# EAGLE design Carduino (EAGLE 9.6.2)
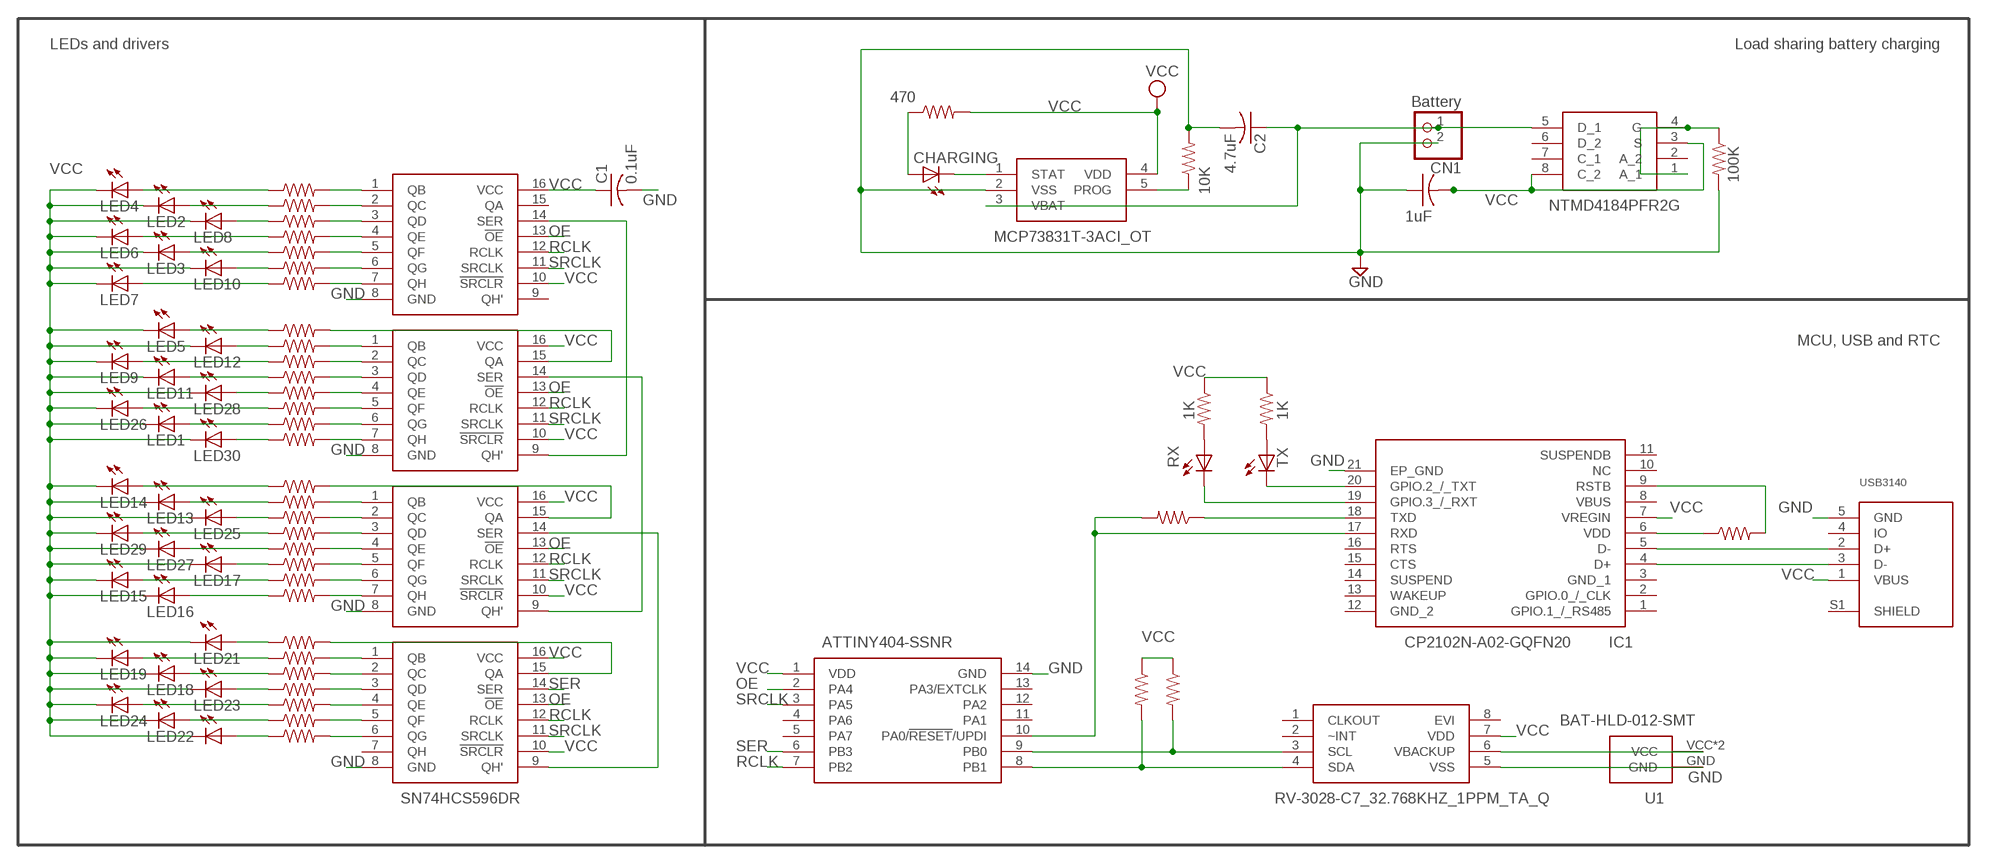
[diagram p0: schematic, sheet 1]

## Parts
C1  0.1uF  C-USC1206  [C1206]
C2  4.7uF  C-USC1206  [C1206]
C3  1uF  C-USC1206  [C1206]
CHARGING  Red  LEDCHIP-LED0805  [CHIP-LED0805]
CN1  Battery  JST_2PIN-SMT-RA  [JST-PH-2-SMT-RA]
IC1  CP2102N-A02-GQFN20  [CP2102NA02GQFN20]
IC3  SN74HCS596DR  [SOIC127P600X175-16N]
IC4  SN74HCS596DR  [SOIC127P600X175-16N]
IC5  SN74HCS596DR  [SOIC127P600X175-16N]
IC6  SN74HCS596DR  [SOIC127P600X175-16N]
IC7  NTMD4184PFR2G  [SOIC127P600X175-8N]
IC8  ATTINY404-SSNR  [SOIC127P600X175-14N]
IC9  MCP73831T-3ACI_OT  [SOT95P270X145-5N]
IC11  RV-3028-C7_32.768KHZ_1PPM_TA_Q  [RV3028C732768KHZ1PPMTAQC]
LED1  LUXEON2835L128-1890NA3500001  [LUXEON2835]
LED2  LUXEON2835L128-1890NA3500001  [LUXEON2835]
LED3  LUXEON2835L128-1890NA3500001  [LUXEON2835]
LED4  LUXEON2835L128-1890NA3500001  [LUXEON2835]
LED5  LUXEON2835L128-1890NA3500001  [LUXEON2835]
LED6  LUXEON2835L128-1890NA3500001  [LUXEON2835]
LED7  LUXEON2835L128-1890NA3500001  [LUXEON2835]
LED8  LUXEON2835L128-1890NA3500001  [LUXEON2835]
LED9  LUXEON2835L128-1890NA3500001  [LUXEON2835]
LED10  LUXEON2835L128-1890NA3500001  [LUXEON2835]
LED11  LUXEON2835L128-1890NA3500001  [LUXEON2835]
LED12  LUXEON2835L128-1890NA3500001  [LUXEON2835]
LED13  LUXEON2835L128-1890NA3500001  [LUXEON2835]
LED14  LUXEON2835L128-1890NA3500001  [LUXEON2835]
LED15  LUXEON2835L128-1890NA3500001  [LUXEON2835]
LED16  LUXEON2835L128-1890NA3500001  [LUXEON2835]
LED17  LUXEON2835L128-1890NA3500001  [LUXEON2835]
LED18  LUXEON2835L128-1890NA3500001  [LUXEON2835]
LED19  LUXEON2835L128-1890NA3500001  [LUXEON2835]
LED20  LUXEON2835L128-1890NA3500001  [LUXEON2835]
LED21  LUXEON2835L128-1890NA3500001  [LUXEON2835]
LED22  LUXEON2835L128-1890NA3500001  [LUXEON2835]
LED23  LUXEON2835L128-1890NA3500001  [LUXEON2835]
LED24  LUXEON2835L128-1890NA3500001  [LUXEON2835]
LED25  LUXEON2835L128-1890NA3500001  [LUXEON2835]
LED26  LUXEON2835L128-1890NA3500001  [LUXEON2835]
LED27  LUXEON2835L128-1890NA3500001  [LUXEON2835]
LED28  LUXEON2835L128-1890NA3500001  [LUXEON2835]
LED29  LUXEON2835L128-1890NA3500001  [LUXEON2835]
LED30  LUXEON2835L128-1890NA3500001  [LUXEON2835]
R1  470  R-US_R0805  [R0805]
R2  1K  R-US_R0805  [R0805]
R3  1K  R-US_R0805  [R0805]
R4  4.7K  R-US_R0805  [R0805]
R5  4.7K  R-US_R0805  [R0805]
R7  1K  R-US_R0805  [R0805]
R8  1K  R-US_R0805  [R0805]
R9  1K  R-US_R0805  [R0805]
R10  1K  R-US_R0805  [R0805]
R11  1K  R-US_R0805  [R0805]
R12  1K  R-US_R0805  [R0805]
R13  1K  R-US_R0805  [R0805]
R14  1K  R-US_R0805  [R0805]
R15  1K  R-US_R0805  [R0805]
R16  470  R-US_R0805  [R0805]
R17  1K  R-US_R0805  [R0805]
R18  1K  R-US_R0805  [R0805]
R19  1K  R-US_R0805  [R0805]
R20  1K  R-US_R0805  [R0805]
R21  100K  R-US_R0805  [R0805]
R22  10K  R-US_R0805  [R0805]
R23  1K  R-US_R0805  [R0805]
R31  1K  R-US_R0805  [R0805]
R32  1K  R-US_R0805  [R0805]
R33  1K  R-US_R0805  [R0805]
R34  1K  R-US_R0805  [R0805]
R35  1K  R-US_R0805  [R0805]
R36  1K  R-US_R0805  [R0805]
R37  1K  R-US_R0805  [R0805]
R38  1K  R-US_R0805  [R0805]
R39  1K  R-US_R0805  [R0805]
R40  1K  R-US_R0805  [R0805]
R41  1K  R-US_R0805  [R0805]
R42  1K  R-US_R0805  [R0805]
R43  1K  R-US_R0805  [R0805]
R44  1K  R-US_R0805  [R0805]
R45  1K  R-US_R0805  [R0805]
R46  1K  R-US_R0805  [R0805]
R47  1K  R-US_R0805  [R0805]
RX  Green  LEDCHIP-LED0805  [CHIP-LED0805]
TX  Red  LEDCHIP-LED0805  [CHIP-LED0805]
U1  BAT-HLD-012-SMT  [BATHLD012SMT]
U$5  USB3140  [USB3140-30-0170-0-C]

## Nets
GND: C1.2 C2.2 C3.1 CN1.2 IC1.21(EP_GND) IC3.8(GND) IC4.8(GND) IC5.8(GND) IC6.8(GND) IC8.14(GND) IC9.2(VSS) IC11.5(VSS) R21.2 R22.2 U1.GND U$5.5(GND)
N$1: LED4.ANODE(A) R15.1
N$2: LED2.ANODE(A) R14.1
N$3: LED8.ANODE(A) R13.1
N$4: LED6.ANODE(A) R12.1
N$5: LED3.ANODE(A) R11.1
N$6: LED12.ANODE(A) R7.1
N$7: LED7.ANODE(A) R9.1
N$8: LED5.ANODE(A) R8.1
N$9: LED10.ANODE(A) R10.1
N$10: LED9.ANODE(A) R17.1
N$11: LED11.ANODE(A) R18.1
N$12: LED28.ANODE(A) R19.1
N$13: LED26.ANODE(A) R20.1
N$14: LED1.ANODE(A) R31.1
N$15: LED30.ANODE(A) R32.1
N$16: LED14.ANODE(A) R33.1
N$17: LED13.ANODE(A) R34.1
N$18: LED25.ANODE(A) R35.1
N$19: LED29.ANODE(A) R36.1
N$20: LED27.ANODE(A) R37.1
N$21: LED17.ANODE(A) R38.1
N$22: LED15.ANODE(A) R39.1
N$23: LED16.ANODE(A) R40.1
N$24: LED21.ANODE(A) R41.1
N$25: LED19.ANODE(A) R42.1
N$26: LED18.ANODE(A) R43.1
N$27: LED23.ANODE(A) R44.1
N$28: LED24.ANODE(A) R45.1
N$29: LED22.ANODE(A) R46.1
N$30: LED20.ANODE(A) R47.1
N$31: IC8.8(PB1) IC11.4(SDA) R4.2
N$32: IC8.9(PB0) IC11.3(SCL) R5.2
N$33: IC11.6(VBACKUP) U1.VCC U1.VCC2(VCC)
N$36: IC7.1(A_1) IC7.4(G) R21.1
N$37: IC9.5(PROG) R22.1
N$38: C2.1 CN1.1 IC7.5(D_1) IC9.3(VBAT)
N$39: CHARGING.C IC9.1(STAT)
N$40: CHARGING.A R16.1
N$41: IC1.20(GPIO.2_/_TXT) TX.C
N$42: IC1.19(GPIO.3_/_RXT) RX.C
N$43: IC1.18(TXD) R1.1
N$44: IC1.6(VDD) R23.1
N$45: IC1.9(RSTB) R23.2
N$53: IC3.1(QB) R15.2
N$56: IC3.2(QC) R14.2
N$57: IC3.3(QD) R13.2
N$58: IC3.4(QE) R12.2
N$59: IC3.5(QF) R11.2
N$60: IC3.6(QG) R10.2
N$61: IC3.7(QH) R9.2
N$62: IC4.15(QA) R8.2
N$63: IC4.1(QB) R7.2
N$64: IC4.2(QC) R17.2
N$65: IC4.3(QD) R18.2
N$66: IC4.4(QE) R19.2
N$68: IC4.5(QF) R20.2
N$69: IC4.6(QG) R31.2
N$70: IC4.7(QH) R32.2
N$71: IC5.15(QA) R33.2
N$72: IC5.1(QB) R34.2
N$73: IC5.2(QC) R35.2
N$74: IC5.3(QD) R36.2
N$75: IC5.4(QE) R37.2
N$82: IC5.5(QF) R38.2
N$83: IC5.6(QG) R39.2
N$84: IC5.7(QH) R40.2
N$86: IC6.6(QG) R47.2
N$87: IC6.5(QF) R46.2
N$88: IC6.4(QE) R45.2
N$89: IC6.3(QD) R44.2
N$90: IC6.2(QC) R43.2
N$91: IC6.1(QB) R42.2
N$92: IC6.15(QA) R41.2
N$93: IC5.14(SER) IC6.9(QH')
N$94: IC4.14(SER) IC5.9(QH')
N$95: IC3.14(SER) IC4.9(QH')
N$99: IC1.5(D-) U$5.2(D+)
N$100: IC1.4(D+) U$5.3(D-)
N$103: IC1.17(RXD) IC8.10(PA0/!RESET!/UPDI) R1.2
N$104: R2.2 RX.A
N$105: R3.2 TX.A
OE: IC3.13(!OE) IC4.13(!OE) IC5.13(!OE) IC6.13(!OE) IC8.2(PA4)
RCLK: IC3.12(RCLK) IC4.12(RCLK) IC5.12(RCLK) IC6.12(RCLK) IC8.7(PB2)
SER: IC6.14(SER) IC8.6(PB3)
SRCLK: IC3.11(SRCLK) IC4.11(SRCLK) IC5.11(SRCLK) IC6.11(SRCLK) IC8.3(PA5)
VCC: C1.1 C3.2 IC1.7(VREGIN) IC3.10(!SRCLR) IC3.16(VCC) IC4.10(!SRCLR) IC4.16(VCC) IC5.10(!SRCLR) IC5.16(VCC) IC6.10(!SRCLR) IC6.16(VCC) IC7.3(S) IC7.8(C_2) IC8.1(VDD) IC9.4(VDD) IC11.7(VDD) LED1.CATHODE(C) LED2.CATHODE(C) LED3.CATHODE(C) LED4.CATHODE(C) LED5.CATHODE(C) LED6.CATHODE(C) LED7.CATHODE(C) LED8.CATHODE(C) LED9.CATHODE(C) LED10.CATHODE(C) LED11.CATHODE(C) LED12.CATHODE(C) LED13.CATHODE(C) LED14.CATHODE(C) LED15.CATHODE(C) LED16.CATHODE(C) LED17.CATHODE(C) LED18.CATHODE(C) LED19.CATHODE(C) LED20.CATHODE(C) LED21.CATHODE(C) LED22.CATHODE(C) LED23.CATHODE(C) LED24.CATHODE(C) LED25.CATHODE(C) LED26.CATHODE(C) LED27.CATHODE(C) LED28.CATHODE(C) LED29.CATHODE(C) LED30.CATHODE(C) R2.1 R3.1 R4.1 R5.1 R16.2 U$5.1(VBUS)
Unconnected: IC1.1(GPIO.1_/_RS485) IC1.2(GPIO.0_/_CLK) IC1.3(GND_1) IC1.8(VBUS) IC1.10(NC) IC1.11(SUSPENDB) IC1.12(GND_2) IC1.13(WAKEUP) IC1.14(SUSPEND) IC1.15(CTS) IC1.16(RTS) IC3.9(QH') IC3.15(QA) IC6.7(QH) IC7.2(A_2) IC7.6(D_2) IC7.7(C_1) IC8.4(PA6) IC8.5(PA7) IC8.11(PA1) IC8.12(PA2) IC8.13(PA3/EXTCLK) IC11.1(CLKOUT) IC11.2(~INT) IC11.8(EVI) U$5.4(IO) U$5.S1(SHIELD)

## Notes on the sheet
- LEDs and drivers | Load sharing battery charging
- MCU, USB and RTC

## Library data of the parts
C1-C3 = resistor:C-US: CAPACITOR, American symbol
CHARGING RX TX = adafruit:LED: LED OSRAM: - CHIPLED LG R971, LG N971, LY N971, LG Q971, LY Q971, LO R971, LY R971 LH N974, LH R974 LS Q976, LO Q976, LY Q976 LO Q996 - Hyper CHIPLED LW Q18S LB Q993, LB Q99A, LB R99A - SideLED LS A670, LO A670, LY A670, LG A670, LP A670 LB A673, LV A673, LT A673, LW A673 LH A674 LY A675 LS A676, LA A676, LO A676, LY A676, LW A676 LS A679, LY A679, LG A679 - Hyper Micro SIDELED® LS Y876, LA Y876, LO Y876, LY Y876 LT Y87S - SmartLED LW L88C, LW L88S LB L89C, LB L89S, LG L890 LS L89K, LO L89K, LY L89K LS L896, LA L896, LO L896, LY L896 - TOPLED LS T670, LO T670, LY T670, LG T670, LP T670 LSG T670, LSP T670, LSY T670, LOP T670, LYG T670 LG T671, LOG T671, LSG T671 LB T673, LV T673, LT T673, LW T673 LH T674 LS T676, LA T676, LO T676, LY T676, LB T676, LH T676, LSB T676, LW T676 LB T67C, LV T67C, LT T67C, LS T67K, LO T67K, LY T67K, LW E67C LS E67B, LA E67B, LO E67B, LY E67B, LB E67C, LV E67C, LT E67C LW T67C LS T679, LY T679, LG T679 LS T770, LO T770, LY T770, LG T770, LP T770 LB T773, LV T773, LT T773, LW T773 LH T774 LS E675, LA E675, LY E675, LS T675 LS T776, LA T776, LO T776, LY T776, LB T776 LHGB T686 LT T68C, LB T68C - Hyper Mini TOPLED® LB M676 - Mini TOPLED Santana® LG M470 LS M47K, LO M47K, LY M47K Source: http://www.osram.convergy.de/
CN1 = adafruit:JST_2PIN: JST 2-Pin Connectors of various flavors SMT-RA (S2B-PH-SM4) 4UConnector #17311 SMT (B2B-PH-SM4) THM-RA (S2B-PH) THM (B2B-PH)
IC1 = SamacSys_Parts:CP2102N-A02-GQFN20: USB Interface IC USB to UART bridge - QFN20 Source: Datasheet <https://www.silabs.com/documents/public/data-sheets/cp2102n-datasheet.pdf>; DESCRIPTION: USB Interface IC USB to UART bridge - QFN20; HEIGHT: 0.8mm; MANUFACTURER_NAME: Silicon Labs; MANUFACTURER_PART_NUMBER: CP2102N-A02-GQFN20; MOUSER_PART_NUMBER: 634-CP2102NA02GQFN20; MOUSER_PRICE-STOCK: https://www.mouser.co.uk/ProductDetail/Silicon-Labs/CP2102N-A02-GQFN20?qs=u16ybLDytRaG8WdlP0fT2g%3D%3D
IC3-IC6 = SamacSys_Parts:SN74HCS596DR: Counter Shift Registers 8-bit serial-in/parallel-out shift register 16-SOIC -40 to 125 Source: Datasheet <https://www.ti.com/lit/ds/symlink/sn74hcs596.pdf>; DESCRIPTION: Counter Shift Registers 8-bit serial-in/parallel-out shift register 16-SOIC -40 to 125; HEIGHT: 1.75mm; MANUFACTURER_NAME: Texas Instruments; MANUFACTURER_PART_NUMBER: SN74HCS596DR; MOUSER_PART_NUMBER: 595-SN74HCS596DR; MOUSER_PRICE-STOCK: https://www.mouser.co.uk/ProductDetail/Texas-Instruments/SN74HCS596DR?qs=81r%252BiQLm7BSUYWKUZRnoUA%3D%3D
IC7 = SamacSys_Parts:NTMD4184PFR2G: MOSFET PFET FTKY S08 30V TR 3.8A Source: Datasheet <https://www.onsemi.com/pub/Collateral/NTMD4184PF-D.PDF>; DESCRIPTION: MOSFET PFET FTKY S08 30V TR 3.8A; HEIGHT: 1.75mm; MANUFACTURER_NAME: ON Semiconductor; MANUFACTURER_PART_NUMBER: NTMD4184PFR2G; MOUSER_PART_NUMBER: 863-NTMD4184PFR2G; MOUSER_PRICE-STOCK: https://www.mouser.co.uk/ProductDetail/ON-Semiconductor/NTMD4184PFR2G?qs=WOJDpfhxrCZPr5mnWPOi%252BQ%3D%3D
IC8 = SamacSys_Parts:ATTINY404-SSNR: MICROCHIP - ATTINY404-SSNR - MCU, 8BIT, 20MHZ, SOIC-14 Source: Datasheet <https://datasheet.datasheetarchive.com/originals/distributors/DKDS-39/8204.pdf>; DESCRIPTION: MICROCHIP - ATTINY404-SSNR - MCU, 8BIT, 20MHZ, SOIC-14; HEIGHT: 1.75mm; MANUFACTURER_NAME: Microchip; MANUFACTURER_PART_NUMBER: ATTINY404-SSNR; MOUSER_PART_NUMBER: 556-ATTINY404-SSNR; MOUSER_PRICE-STOCK: https://www.mouser.co.uk/ProductDetail/Microchip-Technology-Atmel/ATTINY404-SSNR?qs=F5EMLAvA7IAEqD7Aw0z%252B9Q%3D%3D
IC9 = SamacSys_Parts:MCP73831T-3ACI_OT: MICROCHIP - MCP73831T-3ACI/OT - BATT CHARGER, -40 TO 85DEG C Source: Datasheet <http://ww1.microchip.com/downloads/en/DeviceDoc/20001984g.pdf>; DESCRIPTION: MICROCHIP - MCP73831T-3ACI/OT - BATT CHARGER, -40 TO 85DEG C; HEIGHT: 1.45mm; MANUFACTURER_NAME: Microchip; MANUFACTURER_PART_NUMBER: MCP73831T-3ACI/OT; MOUSER_PART_NUMBER: 579-MCP73831T-3ACIOT; MOUSER_PRICE-STOCK: https://www.mouser.co.uk/ProductDetail/Microchip-Technology/MCP73831T-3ACI-OT?qs=yUQqVecv4quInAWkk8YFWg%3D%3D
IC11 = SamacSys_Parts:RV-3028-C7_32.768KHZ_1PPM_TA_Q: Real Time Clock 32.768kHz I2C Time Acc. 1ppm Source: Datasheet <https://www.mouser.de/datasheet/2/530/RV_3028_C7-1524919.pdf>; DESCRIPTION: Real Time Clock 32.768kHz I2C Time Acc. 1ppm; HEIGHT: 0.8mm; MANUFACTURER_NAME: Micro Crystal AG; MANUFACTURER_PART_NUMBER: RV-3028-C7 32.768kHz 1ppm TA QC; MOUSER_PART_NUMBER: 428-203591-MG01; MOUSER_PRICE-STOCK: https://www.mouser.co.uk/ProductDetail/Micro-Crystal/RV-3028-C7-32768kHz-1ppm-TA-QC?qs=u16ybLDytRaU7ZFJl2AxfQ%3D%3D
LED1-LED30 = spkl:LUXEON2835
R1-R5 R7-R23 R31-R47 = adafruit:R-US_: RESISTOR, American symbol
U1 = SamacSys_Parts:BAT-HLD-012-SMT: Coin Cell Battery Holders Bat Hld CR1216/1225 Surface Mount Source: Datasheet <https://linxtechnologies.com/wp/wp-content/uploads/bat-hld-012-smt.pdf>; DESCRIPTION: Coin Cell Battery Holders Bat Hld CR1216/1225 Surface Mount; HEIGHT: 3mm; MANUFACTURER_NAME: Linx Technologies; MANUFACTURER_PART_NUMBER: BAT-HLD-012-SMT; MOUSER_PART_NUMBER: 712-BAT-HLD-012-SMT; MOUSER_PRICE-STOCK: https://www.mouser.co.uk/ProductDetail/Linx-Technologies/BAT-HLD-012-SMT?qs=Z0V%2FpEl%252BOGfZsSJil9WIXw%3D%3D
U$5 = USB:USB3140

## Board
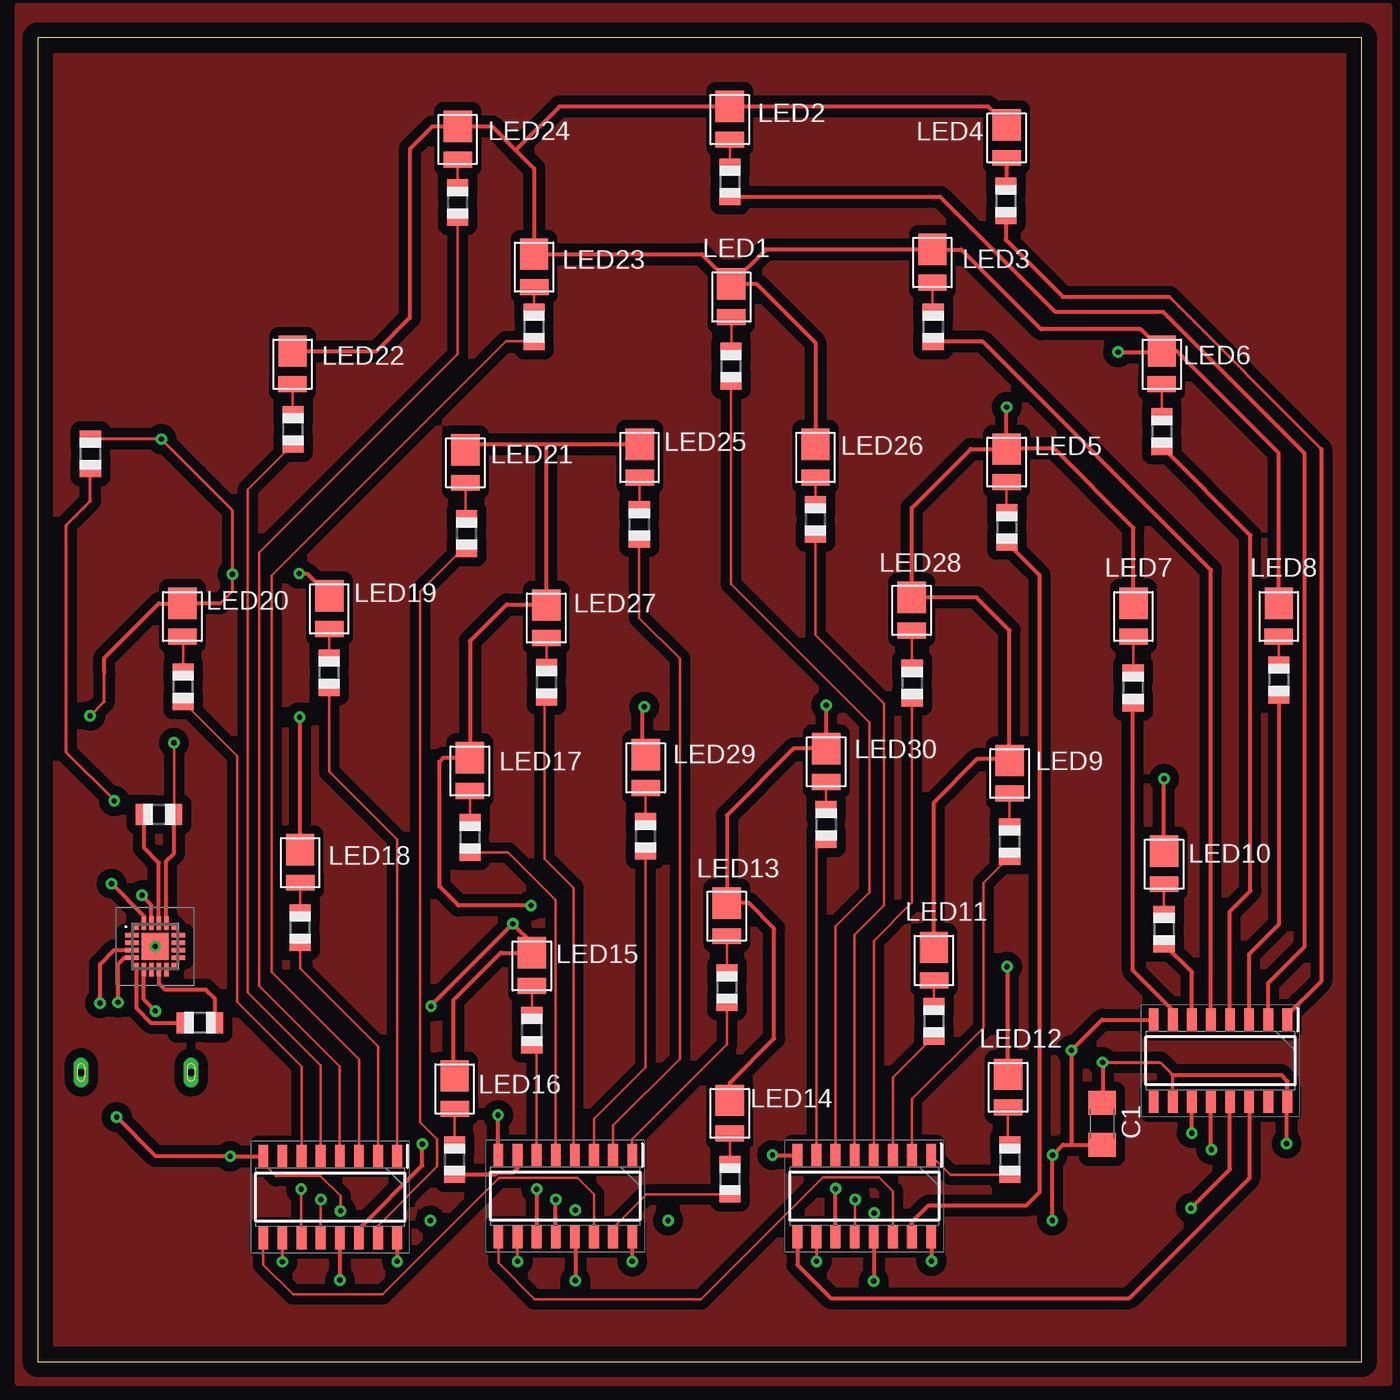
[diagram p1: board, top side]
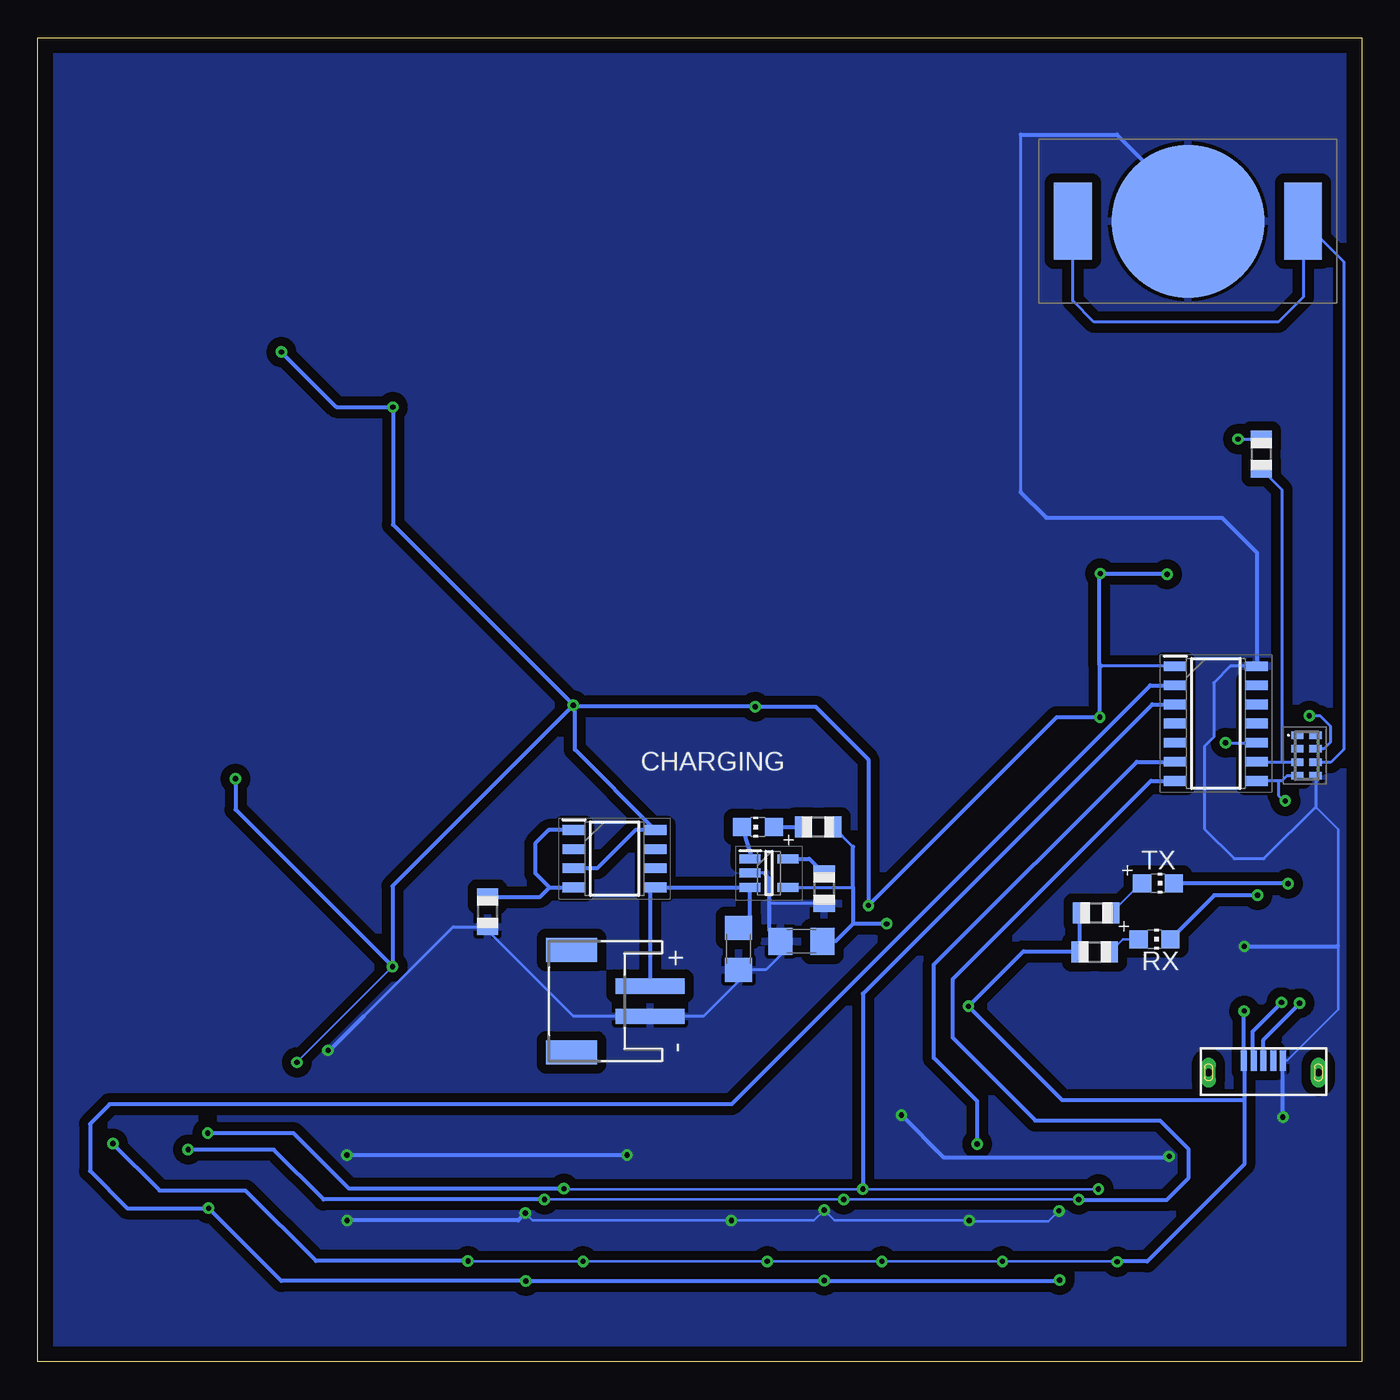
[diagram p2: board, bottom side, seen from below]

Size 88 x 88 mm. Coordinates in mm from the lower left corner, seen from the top.
Outline: 0,0 88,0 88,88 0,88 0,0
Copper layers (1*16): Top 0.035mm / dielectric 1.5mm / Bottom 0.035mm
Design rules "default": minimum track width 6mil, minimum drill 0.35mm, track to track 6mil, track to pad 6mil, pad to pad 6mil, via to via 6mil, smd to smd 6mil, copper to edge 40mil, drill to drill 6mil, minimum pad ring 10mil, minimum via ring 8mil, stop-mask expansion 4mil, vias tented up to drill 0mil, thermal gap 10mil

### Footprints (pad centres in the part's own frame; a part is rotated, then mirrored left to right if it is on the bottom)
C1206 = smd 1.6 x 1.8: 1 -1.4,0; 2 1.4,0
CHIP-LED0805 = smd 1.2 x 1.2: A 0,-1.05; C 0,1.05
JST-PH-2-SMT-RA = smd 1 x 4.6: 1 1,-3.7; 2 -1,-3.7 | smd 1.6 x 3.4: NC1 -3.4,1.5; NC2 3.4,1.5
CP2102NA02GQFN20 = smd 0.3 x 0.3: 1 -1.25,1.25; 6 -1.25,-1.25; 11 1.25,-1.25; 16 1.25,1.25 | smd 0.9 x 0.3: 2 -1.55,0.75; 3 -1.55,0.25; 4 -1.55,-0.25; 5 -1.55,-0.75; 12 1.55,-0.75; 13 1.55,-0.25; 14 1.55,0.25; 15 1.55,0.75 | smd 0.3 x 0.9: 7 -0.75,-1.55; 8 -0.25,-1.55; 9 0.25,-1.55; 10 0.75,-1.55; 17 0.75,1.55; 18 0.25,1.55; 19 -0.25,1.55; 20 -0.75,1.55 | smd 1.8 x 1.8: 21 0,0
SOIC127P600X175-16N = smd 1.525 x 0.65: 1 -2.712,4.445; 2 -2.712,3.175; 3 -2.712,1.905; 4 -2.712,0.635; 5 -2.712,-0.635; 6 -2.712,-1.905; 7 -2.712,-3.175; 8 -2.712,-4.445; 9 2.712,-4.445; 10 2.712,-3.175; 11 2.712,-1.905; 12 2.712,-0.635; 13 2.712,0.635; 14 2.712,1.905; 15 2.712,3.175; 16 2.712,4.445
SOIC127P600X175-8N = smd 1.5 x 0.65: 1 -2.7,1.905; 2 -2.7,0.635; 3 -2.7,-0.635; 4 -2.7,-1.905; 5 2.7,-1.905; 6 2.7,-0.635; 7 2.7,0.635; 8 2.7,1.905
SOIC127P600X175-14N = smd 1.5 x 0.65: 1 -2.7,3.81; 2 -2.7,2.54; 3 -2.7,1.27; 4 -2.7,0; 5 -2.7,-1.27; 6 -2.7,-2.54; 7 -2.7,-3.81; 8 2.7,-3.81; 9 2.7,-2.54; 10 2.7,-1.27; 11 2.7,0; 12 2.7,1.27; 13 2.7,2.54; 14 2.7,3.81
SOT95P270X145-5N = smd 1.4 x 0.6: 1 -1.25,0.95; 2 -1.25,0; 3 -1.25,-0.95; 4 1.25,-0.95; 5 1.25,0.95
RV3028C732768KHZ1PPMTAQC = smd 0.5 x 0.8: 1 -1.35,-0.6; 2 -0.45,-0.6; 3 0.45,-0.6; 4 1.35,-0.6; 5 1.35,0.6; 6 0.45,0.6; 7 -0.45,0.6; 8 -1.35,0.6
LUXEON2835 = smd 1 x 1.9: ANODE 1.43,0 | smd 2.03 x 1.9: CATHODE -0.77,0
R0805 = smd 1.1 x 1.4: 1 -1,0; 2 1,0
BATHLD012SMT = smd 10.16 x 10.16: GND 0,0 | smd 2.5 x 5.1: VCC -7.65,0; VCC2 7.65,0
USB3140-30-0170-0-C = smd 0.4 x 1.35: 1 -1.3,0; 2 -0.65,0; 3 0,0; 4 0.65,0; 5 1.3,0 | drill 0.5 pad 0.775 long: S1 3.65,-0.8; S3 -3.65,-0.8

### Placement (x,y rotation side)
C1  70.74,15.82 270 top
C2  41.43,27.45 270 bottom
C3  37.24,27.95 0 bottom
CHARGING  40.13,35.54 90 bottom
CN1  51.01,23.97 90 bottom
IC1  7.81,27.61 0 top
IC3  78.6,20.02 270 top
IC4  54.93,11.02 270 top
IC5  35.07,11.02 270 top
IC6  19.45,10.95 270 top
IC7  49.66,33.44 0 bottom
IC8  9.7,42.42 0 bottom
IC9  39.4,32.48 0 bottom
IC11  3.68,40.29 270 bottom
LED1  46.1,70.87 270 top
LED2  46,82.65 270 top
LED3  59.46,73.15 270 top
LED4  64.39,81.43 270 top
LED5  64.39,59.89 270 top
LED6  74.7,66.4 270 top
LED7  72.82,49.63 270 top
LED8  82.47,49.63 270 top
LED9  64.59,39.2 270 top
LED10  74.85,33.17 270 top
LED11  59.56,26.77 270 top
LED12  64.49,18.34 270 top
LED13  45.8,29.72 270 top
LED14  46,16.61 270 top
LED15  32.84,26.42 270 top
LED16  27.71,18.24 270 top
LED17  28.73,39.37 270 top
LED18  17.45,33.27 270 top
LED19  19.38,50.14 270 top
LED20  9.63,49.63 270 top
LED21  28.42,59.84 270 top
LED22  16.94,66.4 270 top
LED23  32.99,72.85 270 top
LED24  27.91,81.33 270 top
LED25  40.01,60.2 270 top
LED26  51.69,60.2 270 top
LED27  33.81,49.53 270 top
LED28  58.09,50.04 270 top
LED29  40.41,39.57 270 top
LED30  52.4,39.98 270 top
R1  8.07,36.39 0 top
R2  17.75,27.23 0 bottom
R3  17.65,29.84 0 bottom
R4  3.51,60.35 270 top
R5  6.68,60.32 270 bottom
R7  64.62,13.44 270 top
R8  64.41,55.45 270 top
R9  72.8,44.78 270 top
R10  74.85,28.75 270 top
R11  59.51,68.78 270 top
R12  74.7,61.82 270 top
R13  82.47,45.31 270 top
R14  46,78.41 270 top
R15  64.34,77.14 270 top
R16  36.13,35.54 0 bottom
R17  64.59,34.57 270 top
R18  59.56,22.63 270 top
R19  58.12,45.11 270 top
R20  51.69,55.98 270 top
R21  58.1,29.91 270 bottom
R22  35.73,31.45 270 bottom
R23  10.79,22.54 0 top
R31  46.08,66.17 270 top
R32  52.4,35.71 270 top
R33  46,12.14 270 top
R34  45.82,24.87 270 top
R35  39.98,55.65 270 top
R36  40.39,34.92 270 top
R37  33.81,45.16 270 top
R38  28.73,34.85 270 top
R39  32.84,22.05 270 top
R40  27.71,13.44 270 top
R41  28.5,55.04 270 top
R42  19.38,45.8 270 top
R43  17.45,28.85 270 top
R44  32.99,68.78 270 top
R45  27.91,77.04 270 top
R46  16.97,61.98 270 top
R47  9.68,44.86 270 top
RX  13.79,28.09 270 bottom
TX  13.55,31.81 270 bottom
U1  11.56,75.79 0 bottom
U$5  6.54,20.03 0 bottom

### Tracks (layer width: path | path; a pad name or v marks a point on that pad's centre or on a via)
GND  (via drill 0.35)
  Top 0.152: v20.13,10.03 20.13,11.02 18.79,12.37 15.86,12.37 15.84,12.34 15,13.18 15,13.5
  Top 0.254: v67.43,9.39 67.43,13.76 v67.45,13.74 68.14,14.42 68.7,14.42 | 68.7,14.42 v68.7,20.7 70.73,22.73 IC3.8 | 68.7,14.42 C1.2 | v48.83,13.74 IC4.8 | IC5.8 30.6,13.76 v30.6,16.4 | 15,13.5 IC6.8 v12.8,13.66 7.86,13.66 v5.25,16.27
  Bottom 0.152: v20.13,10.03 20.83,9.33 26.05,9.33 v26.1,9.38 26.13,9.41 35.06,9.41 v35.73,10.08 36.42,9.39 41.89,9.39 v41.9,9.38 41.93,9.41 55.12,9.41 v55.59,9.88 | 3.04,36.83 1.58,35.37 1.58,27.67 1.58,23.42 4.97,20.03 5.12,20.03 | 5.12,20.03 U$5.5 | 5.22,19.93 5.12,20.03
  Bottom 0.2: 3.08,36.87 6.51,33.44 8.49,33.44 10.47,35.42 10.47,40.9 9.85,41.52 9.85,45.12 8.74,46.23 IC8.14 6.97,46.26 | 22.66,81.56 22.69,81.53 22.69,57.81 | IC11.5 3.08,36.87 | 3.08,36.87 3.04,36.83 | R22.2 39.36,30.45 | 39.73,32.48 IC9.2 | 66.33,22.97 60.39,28.91 58.33,28.91 | 58.33,28.91 R21.2 | 58.33,28.91 52.39,22.97 CN1.2 43.74,22.97 41.43,25.28 C2.2 39.61,26.05 38.64,27.02 C3.1
  Bottom 0.254: v55.59,9.88 56.07,9.4 v67.43,9.4 v67.43,9.39 | v30.6,16.4 27.8,13.6 12.8,13.6 v12.8,13.66 | 22.69,57.81 20.97,56.09 9.3,56.09 6.97,53.77 6.97,46.26 | 22.66,81.56 16.27,81.56 11.56,76.85 U1.GND | 66.33,22.97 68.7,20.6 v68.7,20.7 | 39.73,32.48 39.39,32.14 39.39,30.42 | 39.36,30.45 39.39,30.42 | 38.73,28.04 C3.1 39.39,28.7 39.39,30.42 | v48.83,13.74 v67.45,13.74 | v5.25,16.27 5.25,19.9 5.22,19.93 | IC1.21 1.64,27.61 1.58,27.67
  other vias: 7.81,27.61
  pour Bottom (isolate 0.61): -1.4,89.69 89.88,89.69 89.88,-1.17 -1.4,-1.17
N$1
  Top 0.254: R15.1 64.39,78.19 LED4.ANODE
N$2
  Top 0.152: LED2.ANODE R14.1
N$3
  Top 0.152: LED8.ANODE R13.1
N$4
  Top 0.152: LED6.ANODE R12.1
N$5
  Top 0.152: LED3.ANODE 59.46,69.83 R11.1
N$6
  Top 0.152: LED12.ANODE 64.49,14.56 R7.1
N$7
  Top 0.152: LED7.ANODE 72.82,45.81 R9.1
N$8
  Top 0.152: LED5.ANODE 64.39,56.47 R8.1
N$9
  Top 0.152: LED10.ANODE R10.1
N$10
  Top 0.152: LED9.ANODE R17.1
N$11
  Top 0.152: LED11.ANODE R18.1
N$12
  Top 0.152: LED28.ANODE 58.09,46.14 R19.1
N$13
  Top 0.152: LED26.ANODE R20.1
N$14
  Top 0.152: LED1.ANODE 46.1,67.19 R31.1
N$15
  Top 0.152: LED30.ANODE R32.1
N$16
  Top 0.152: LED14.ANODE R33.1
N$17
  Top 0.152: LED13.ANODE 45.8,25.89 R34.1
N$18
  Top 0.152: LED25.ANODE 40.01,56.68 R35.1
N$19
  Top 0.152: LED29.ANODE 40.41,35.95 R36.1
N$20
  Top 0.152: LED27.ANODE R37.1
N$21
  Top 0.152: LED17.ANODE R38.1
N$22
  Top 0.152: LED15.ANODE R39.1
N$23
  Top 0.152: LED16.ANODE R40.1
N$24
  Top 0.152: LED21.ANODE 28.42,56.12 R41.1
N$25
  Top 0.152: LED19.ANODE R42.1
N$26
  Top 0.152: LED18.ANODE R43.1
N$27
  Top 0.152: LED23.ANODE R44.1
N$28
  Top 0.152: LED24.ANODE R45.1
N$29
  Top 0.152: LED22.ANODE 16.94,63 R46.1
N$30
  Top 0.152: LED20.ANODE 9.68,48.15 R47.1
N$31  (via drill 0.35)
  Top 0.2: v5.09,37.28 5.09,37.33 1.91,40.51 1.91,55.6 3.51,57.2 R4.2
  Bottom 0.2: IC11.4 4.98,38.94 5.31,38.61 5.55,38.61 | 5.55,38.61 IC8.8 | 5.55,38.61 5.55,37.64 5.14,37.23 v5.09,37.28
N$32
  Bottom 0.2: IC11.3 5.31,39.84 | 5.31,39.84 6.96,39.84 IC8.9 | R5.2 5.31,57.95 5.31,39.84
N$33
  Bottom 0.2: IC11.6 2.07,39.84 1.21,40.7 1.21,73.1 U1.VCC2 3.91,70.75 5.56,69.1 17.8,69.1 19.21,70.51 U1.VCC
N$36
  Bottom 0.254: IC7.1 54.05,35.34 54.94,34.45 54.94,32.49 53.98,31.54 | 53.98,31.54 IC7.4 | R21.1 54.61,30.91 53.98,31.54
N$37
  Bottom 0.254: IC9.5 36.71,33.43 R22.1
N$38
  Bottom 0.254: C2.1 40.65,29.63 IC9.3 IC7.5 47.31,31.18 CN1.1
N$39
  Bottom 0.254: CHARGING.C 40.56,33.52 IC9.1
N$40
  Bottom 0.254: CHARGING.A R16.1
N$41  (via drill 0.35)
  Top 0.254: IC1.20 7.06,29.63 v4.91,31.78
  Bottom 0.254: v4.91,31.78 12.48,31.78 TX.C
N$42  (via drill 0.35)
  Top 0.254: IC1.19 7.56,30.36 v6.92,31 v6.93,31.01
  Bottom 0.254: v6.93,31.01 9.82,31.01 RX.C
N$43
  Top 0.254: IC1.18 8.06,33.17 7.07,34.16 R1.1
N$44
  Top 0.254: IC1.6 6.56,23.51 7.53,22.54 R23.1
N$45
  Top 0.254: IC1.9 8.06,25.14 8.48,24.72 11.18,24.72 11.79,24.11 R23.2
N$53
  Top 0.2: 75.19,70.78 85.3,60.67
  Top 0.254: IC3.1 83.05,23.05 85.3,25.3 85.3,60.67 | R15.2 64.34,74.57 68.13,70.78 75.19,70.78
N$56
  Top 0.254: IC3.2 81.78,25.18 84.2,27.6 84.2,60.35 74.79,69.76 67.64,69.76 59.99,77.41 R14.2
N$57
  Top 0.254: IC3.3 80.51,27.11 82.5,29.1 82.5,44.29 R13.2
N$58
  Top 0.254: IC3.4 79.24,29.94 80.6,31.3 80.6,54.92 R12.2
N$59
  Top 0.254: IC3.5 77.97,52.63 62.82,67.78 R11.2
N$60
  Top 0.254: IC3.6 76.7,25.91 R10.2
N$61
  Top 0.254: IC3.7 75.43,23.37 72.8,26 R9.2
N$62
  Top 0.254: IC4.15 58.1,9.3 59.2,10.4 65.7,10.4 66.6,11.3 66.6,52.26 R8.2
N$63
  Top 0.152: IC4.1 60.67,12.44 R7.2
N$64
  Top 0.152: IC4.2 58.1,17.46 62.84,22.2 62.84,31.82 R17.2
N$65
  Top 0.152: IC4.3 56.83,18.9 R18.2
N$66
  Top 0.152: IC4.4 55.56,27.98 58.12,30.53 R19.2
N$68
  Top 0.152: IC4.5 54.29,28.39 56.24,30.33 56.24,43.74 51.69,48.28 R20.2
N$69
  Top 0.152: IC4.6 53.02,28.95 55.27,31.19 55.27,42.49 46.08,51.69 R31.2
N$70
  Top 0.152: R32.2 51.75,34.07 IC4.7
N$71
  Top 0.152: IC5.15 38.24,8.91 40.47,11.14 R33.2
N$72
  Top 0.152: IC5.1 39.51,14.8 45.82,21.11 R34.2
N$73
  Top 0.152: IC5.2 38.24,15.71 42.67,20.14 42.67,46.74 39.98,49.43 R35.2
N$74
  Top 0.152: IC5.3 36.97,16.14 40.39,19.56 R36.2
N$75
  Top 0.152: IC5.4 35.62,13.81 35.62,31.48 33.68,33.43 33.68,44.03 R37.2
N$82
  Top 0.152: IC5.5 34.41,13.76 34.41,30.69 31.25,33.85 R38.2
N$83
  Top 0.152: R39.2 33.16,20.73 IC5.6
N$84
  Top 0.254: IC5.7 31.89,12.86 31.6,12.57 30.52,12.57 30.39,12.44 R40.2
N$86
  Top 0.152: IC6.6 17.54,19.63 13.26,23.91 13.26,40.28 R47.2
N$87
  Top 0.152: IC6.5 18.81,19.7 13.97,24.54 13.97,57.98 R46.2
N$88
  Top 0.152: IC6.4 20.08,19.64 14.73,25 14.73,53.79 27.91,66.98 R45.2
N$89
  Top 0.152: IC6.3 21.35,20.1 15.54,25.91 15.54,52.25 31.11,67.82 32.96,67.82 R44.2
N$90
  Top 0.152: IC6.2 22.62,20.97 17.45,26.14 R43.2
N$91
  Top 0.152: IC6.1 23.89,34.71 19.38,39.22 R42.2
N$92
  Top 0.152: R41.2 28.27,54.04 25.43,51.2 25.43,15.91 26.56,14.78 26.56,12.98 22.62,9.04 IC6.15
N$93
  Top 0.152: IC6.9 15,6.45 16.97,4.48 22.93,4.48 30.67,12.22 35.88,12.22 36.97,11.12 IC5.14
N$94
  Top 0.152: IC5.9 30.62,6.58 33.03,4.17 44.09,4.17 52.19,12.27 55.89,12.27 56.83,11.33 IC4.14
N$95
  Top 0.254: IC4.9 50.48,6.46 52.71,4.23 72.53,4.23 80.51,12.21 IC3.14
N$99  (via drill 0.35)
  Top 0.254: v5.33,23.89 v5.34,23.9 5.34,26.43 5.77,26.86 IC1.5
  Bottom 0.152: U$5.2 7.26,20.1
  Bottom 0.254: 7.26,20.1 7.26,21.96 v5.33,23.89
N$100  (via drill 0.35)
  Top 0.254: v4.14,23.84 4.14,26.41 5.09,27.36 IC1.4
  Bottom 0.254: U$5.3 6.54,21.39 4.12,23.81 v4.14,23.84
N$103  (via drill 0.35)
  Top 0.152: R1.2 9.07,41.09
  Top 0.2: 9.07,41.09 9.04,41.12 v9.06,41.14
  Top 0.254: IC1.17 8.56,33.28 9.07,33.79 R1.2
  Bottom 0.2: v9.06,41.14 IC8.10
N$104
  Bottom 0.152: R2.2 15.89,28.09 RX.A
N$105
  Bottom 0.152: R3.2 14.69,31.8 TX.A
OE  (via drill 0.35)
  Top 0.254: v55.56,5.38 55.54,5.4 55.56,5.42 IC4.13 | v35.73,5.4 35.73,8.28 IC5.13 | IC3.13 79.24,12.81 v76.64,10.21 | v20.09,5.43 IC6.13
  Bottom 0.254: v20.09,5.43 20.12,5.4 v35.73,5.4 35.73,5.38 v55.56,5.38 71.81,5.38 v76.64,10.21 82.05,10.21 84.52,12.68 84.52,15.81 83.21,17.12 41.9,17.12 14.06,44.96 IC8.2
RCLK  (via drill 0.35)
  Top 0.152: v54.32,10.79 54.32,8.78 | 18.82,8.25 v18.82,10.78
  Top 0.254: v78,14.1 77.97,14.13 IC3.12 | IC4.12 54.29,8.76 54.32,8.78 | IC5.12 v34.43,10.79 | IC6.12 18.82,8.25
  Bottom 0.152: v54.32,10.79 v34.43,10.79 18.91,10.79 18.86,10.74 v18.82,10.78
  Bottom 0.254: v78,14.1 72.3,14.1 68.99,10.79 v54.32,10.79 | 18.86,10.74 12.99,10.74 11.54,12.19 11.54,14.16 13.42,16.04 21.7,16.04 27.21,21.55 27.21,25.41 14.01,38.61 IC8.7
SER  (via drill 0.35)
  Top 0.254: IC6.14 21.35,8.85 25.55,13.05 v25.55,14.46 v25.56,14.47
  Bottom 0.254: v25.56,14.47 25.56,17.32 28.44,20.2 28.44,26.4 14.96,39.88 IC8.6
SRCLK  (via drill 0.35)
  Top 0.152: 17.52,8.26 v17.52,11.48
  Top 0.254: v76.7,15.2 | v76.7,15.2 IC3.11 | IC4.11 v53.02,11.51 | v33.16,11.48 IC5.11 | IC6.11 17.52,8.26
  Bottom 0.152: v17.52,11.48 v33.16,11.48 53,11.48 v53.02,11.51
  Bottom 0.254: v53.02,11.51 67.31,11.51 71,15.2 v76.7,15.2 | v33.16,11.48 33.16,24.46 13.93,43.69 IC8.3
TOPSIGNAL
  pour Top (isolate 0.61): -1.3,90.06 89.8,90.06 89.8,-1.35 -1.3,-1.35
VCC  (via drill 0.35)
  Top 0.2: 4.44,45.83 4.44,43.87 v3.5,42.93 v3.49,42.93 | 12.12,50.4 12.95,51.23 v12.95,52.34 12.95,56.59 v8.22,61.32 8.2,61.34 R4.1 | IC3.10 75.43,19.07 74.6,19.9 v70.78,19.9 | v31.89,6.68 IC5.10 | v16.27,6.65 IC6.10 | IC4.10 v51.75,6.68
  Top 0.254: v17.38,52.38 17.91,52.38 LED19.CATHODE | v32.79,30.33 27.96,30.33 26.7,31.6 26.7,39.88 26.96,40.14 LED17.CATHODE 28.73,47.9 31.17,50.34 33.81,50.34 | v40.31,43.54 40.21,43.54 40.21,40.55 LED29.CATHODE | 75.43,19.07 82.63,19.07 83.05,18.65 IC3.16 83.05,17.19 83,17.14 v83,14.5 | v26.15,23.63 26.15,23.7 26.16,23.7 v31.57,29.11 32.84,27.84 LED15.CATHODE 30.77,27.19 27.61,24.03 27.61,19.11 LED16.CATHODE | v70.78,19.9 70.78,17.26 C1.1 | IC6.16 v23.89,6.68 | IC5.16 v39.51,6.68 | IC4.16 59.4,8.29 v59.4,6.71 | LED22.CATHODE 22.51,67.17 24.73,69.39 24.73,80.59 26.25,82.1 LED24.CATHODE 30.19,82.1 31.77,80.52 | 31.77,80.52 32.99,79.3 LED23.CATHODE 44.12,73.62 LED1.CATHODE | 31.77,80.52 34.68,83.42 LED2.CATHODE 63.17,83.42 LED4.CATHODE | LED1.CATHODE 48.39,73.92 LED3.CATHODE 61.37,73.92 66.68,68.61 73.31,68.61 74.75,67.17 | LED1.CATHODE 47.77,71.64 51.69,67.72 LED26.CATHODE | LED25.CATHODE 33.81,60.97 | 33.81,60.97 28.78,60.97 LED21.CATHODE | LED27.CATHODE 33.81,50.34 | 33.81,50.34 33.81,60.97 | LED9.CATHODE 64.59,40.08 | 64.59,40.08 64.59,48.62 62.4,50.81 LED28.CATHODE 58.09,56.74 62.01,60.66 LED5.CATHODE | LED11.CATHODE 59.56,37.19 62.46,40.08 64.59,40.08 | LED8.CATHODE 82.47,60.4 75.71,67.17 74.75,67.17 | 74.75,67.17 LED6.CATHODE | LED14.CATHODE 46,18.54 48.95,21.49 48.95,28.8 47.26,30.49 LED13.CATHODE 45.8,36.32 50.22,40.75 LED30.CATHODE v52.4,43.64 | LED7.CATHODE 72.82,55.42 67.56,60.68 64.41,60.68 LED5.CATHODE | LED10.CATHODE v74.85,38.76 | v71.81,67.11 74.69,67.11 74.75,67.17 | 12.12,50.4 LED20.CATHODE 8.06,50.4 4.44,46.78 4.44,45.83 | LED12.CATHODE 64.49,26.19 v64.41,26.26
  Top 0.254: LED18.CATHODE 17.45,42.8 v17.41,42.84 | LED5.CATHODE v64.39,63.45 | v7.82,23.32 7.06,24.08 IC1.7
  Bottom 0.152: v16.27,6.65 16.3,6.68 16.38,6.68 v23.89,6.68 v31.89,6.68 v39.51,6.68 v51.75,6.68 59.35,6.68 59.36,6.67 v59.4,6.71 | v70.78,19.9 v64.41,26.26
  Bottom 0.2: v3.49,42.93 2.78,42.93 2.08,42.23 2.08,41.18 2.52,40.74 IC11.7 | IC9.4 33.83,31.53 33.81,31.51 | 33.81,34.22 R16.2 | v8.22,61.32 R5.1 | IC8.1 17.33,46.23
  Bottom 0.254: v12.95,52.34 13,52.38 v17.38,52.38 17.45,52.31 17.45,46.35 17.41,46.31 | 17.41,46.31 v17.41,42.84 20.28,42.84 v32.79,30.33 32.79,40.02 36.31,43.54 v40.31,43.54 52.3,43.54 | v52.4,43.64 64.39,55.63 v64.39,63.45 68.15,63.45 v71.81,67.11 | v74.85,38.76 74.85,36.7 v64.41,26.26 64.41,31.62 v52.4,43.64 | 52.3,43.54 v52.4,43.64 | v59.4,6.71 69.5,6.71 74.2,11.4 79.9,11.4 v83,14.5 | 17.33,46.23 17.41,46.31 | 16.38,6.68 14.26,6.68 7.83,13.12 7.83,17.46 | 52.3,43.54 52.3,40.68 IC7.8 48.27,35.34 50.81,32.8 IC7.3 | v31.57,29.11 33.81,29.11 | 33.81,29.11 33.81,31.51 33.81,34.22 | 7.83,17.46 7.83,20.02 U$5.1 7.84,23.21 7.82,23.23 v7.82,23.32 | 7.83,17.46 7.88,17.41 19.93,17.41 v26.15,23.63 22.49,27.29 18.81,27.29 R2.1 18.75,29.74 R3.1 | 33.81,29.11 34.97,27.95 C3.2

### Text on the board
200bmp: C:/Users/pierr/Documents/Sparkle/vanillalogo.bmp